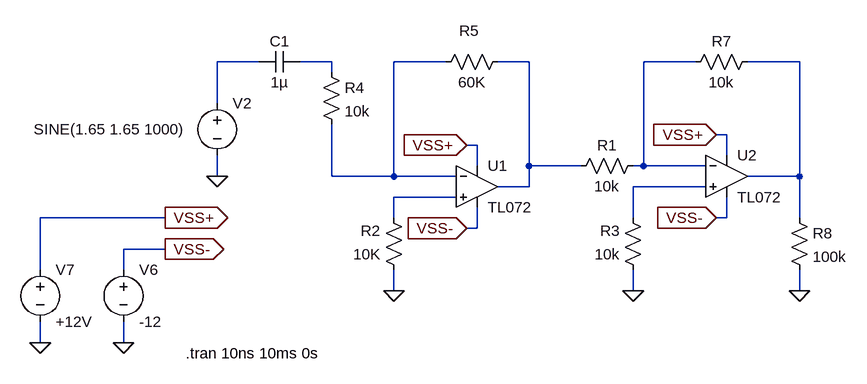
[diagram p0: schematic phr-eurpi-ext-04.asc]
phr-eurpi-ext-04.asc, the LTspice schematic file:
Version 4
SHEET 1 1072 680
WIRE 128 48 64 48
WIRE 240 48 192 48
WIRE 416 48 336 48
WIRE 544 48 496 48
WIRE 800 48 720 48
WIRE 960 48 880 48
WIRE 240 64 240 48
WIRE 64 112 64 48
WIRE 848 160 832 160
WIRE 464 176 448 176
WIRE 848 192 848 160
WIRE 464 208 464 176
WIRE 544 208 544 48
WIRE 624 208 544 208
WIRE 720 208 720 48
WIRE 720 208 704 208
WIRE 816 208 720 208
WIRE 64 224 64 192
WIRE 240 224 240 144
WIRE 336 224 336 48
WIRE 336 224 240 224
WIRE 432 224 336 224
WIRE 960 224 960 48
WIRE 960 224 880 224
WIRE 544 240 544 208
WIRE 544 240 496 240
WIRE 816 240 704 240
WIRE 432 256 336 256
WIRE -16 288 -208 288
WIRE 336 288 336 256
WIRE 704 288 704 240
WIRE 848 288 848 256
WIRE 848 288 832 288
WIRE 960 288 960 224
WIRE 464 304 464 272
WIRE 464 304 448 304
WIRE -16 336 -80 336
WIRE -208 368 -208 288
WIRE -80 368 -80 336
WIRE 336 400 336 368
WIRE 704 400 704 368
WIRE 960 400 960 368
WIRE -208 480 -208 448
WIRE -80 480 -80 448
FLAG 64 224 0
FLAG 336 400 0
FLAG 704 400 0
FLAG 960 400 0
FLAG -16 288 VSS+
IOPIN -16 288 Out
FLAG -16 336 VSS-
IOPIN -16 336 Out
FLAG -80 480 0
FLAG -208 480 0
FLAG 448 304 VSS-
IOPIN 448 304 In
FLAG 448 176 VSS+
IOPIN 448 176 In
FLAG 832 288 VSS-
IOPIN 832 288 In
FLAG 832 160 VSS+
IOPIN 832 160 In
SYMBOL OpAmps/TL072 464 176 R0
SYMATTR InstName U1
SYMBOL Voltage 64 96 R0
WINDOW 3 -282 56 Left 2
SYMATTR Value SINE(1.65 1.65 1000)
SYMATTR InstName V2
SYMBOL Res 352 384 R180
WINDOW 0 36 76 Left 2
WINDOW 3 36 40 Left 2
SYMATTR InstName R2
SYMATTR Value 10K
SYMBOL Res 224 48 R0
SYMATTR InstName R4
SYMATTR Value 10k
SYMBOL Res 512 32 R90
WINDOW 0 -16 60 VBottom 2
WINDOW 3 32 56 VTop 2
SYMATTR InstName R5
SYMATTR Value 60K
SYMBOL Cap 192 32 R90
WINDOW 0 0 32 VBottom 2
WINDOW 3 32 32 VTop 2
SYMATTR InstName C1
SYMATTR Value 1µ
SYMBOL OpAmps/TL072 848 160 R0
SYMATTR InstName U2
SYMBOL Res 720 192 R90
WINDOW 0 0 56 VBottom 2
WINDOW 3 32 56 VTop 2
SYMATTR InstName R1
SYMATTR Value 10k
SYMBOL Res 720 384 R180
WINDOW 0 36 76 Left 2
WINDOW 3 36 40 Left 2
SYMATTR InstName R3
SYMATTR Value 10k
SYMBOL Res 896 32 R90
WINDOW 0 0 56 VBottom 2
WINDOW 3 32 56 VTop 2
SYMATTR InstName R7
SYMATTR Value 10k
SYMBOL Res 944 272 R0
SYMATTR InstName R8
SYMATTR Value 100k
SYMBOL Voltage -80 352 R0
SYMATTR InstName V6
SYMATTR Value -12
SYMBOL Voltage -208 352 R0
SYMATTR InstName V7
SYMATTR Value +12V
TEXT 16 496 Left 2 !.tran 10ns 10ms 0s

The netlist it stands for:
* phr-eurpi-ext-04.asc
XU1 N008 N003 VSS+ VSS- N004 TL072  ; pins In+ In- V+ V- OUT
V2 N001 0 SINE(1.65 1.65 1000)
R2 0 N008 10K
R4 N002 N003 10k
R5 N004 N003 60K
C1 N002 N001 1µ
XU2 N007 N005 VSS+ VSS- N006 TL072  ; pins In+ In- V+ V- OUT
R1 N005 N004 10k
R3 0 N007 10k
R7 N006 N005 10k
R8 N006 0 100k
V6 VSS- 0 -12
V7 VSS+ 0 +12V
.tran 10ns 10ms 0s
.backanno
.end